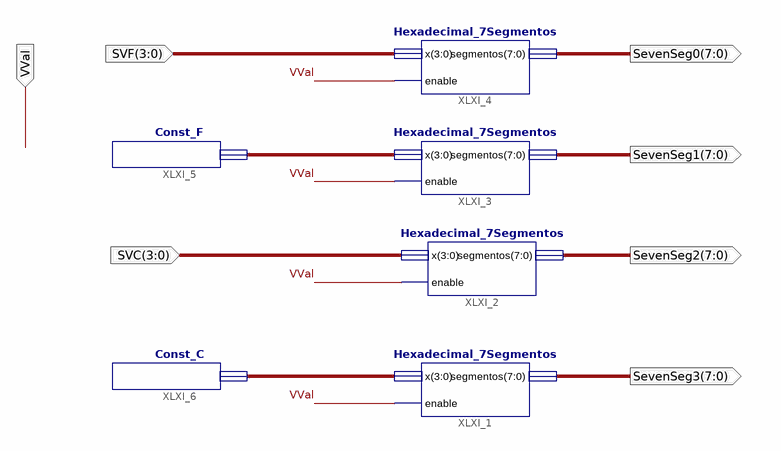
[diagram p0: schematic sheet 1]
// Xilinx ISE schematic Visualiza_Cuenta.sch (spartan6) as structural Verilog: 6 symbols, 7 ports
module Visualiza_Cuenta (
  input  [3:0] SVF,
  input  [3:0] SVC,
  input  VVal,
  output [7:0] SevenSeg0,
  output [7:0] SevenSeg1,
  output [7:0] SevenSeg2,
  output [7:0] SevenSeg3
);

  wire [3:0] XLXN_13, XLXN_14;

  Hexadecimal_7Segmentos XLXI_1 (.enable(VVal), .segmentos(SevenSeg3), .x(XLXN_14));
  Hexadecimal_7Segmentos XLXI_2 (.enable(VVal), .segmentos(SevenSeg2), .x(SVC));
  Hexadecimal_7Segmentos XLXI_3 (.enable(VVal), .segmentos(SevenSeg1), .x(XLXN_13));
  Hexadecimal_7Segmentos XLXI_4 (.enable(VVal), .segmentos(SevenSeg0), .x(SVF));
  Const_F XLXI_5 (.F(XLXN_13));
  Const_C XLXI_6 (.C(XLXN_14));
endmodule
